# EAGLE design Bottom (EAGLE 9.6.2)
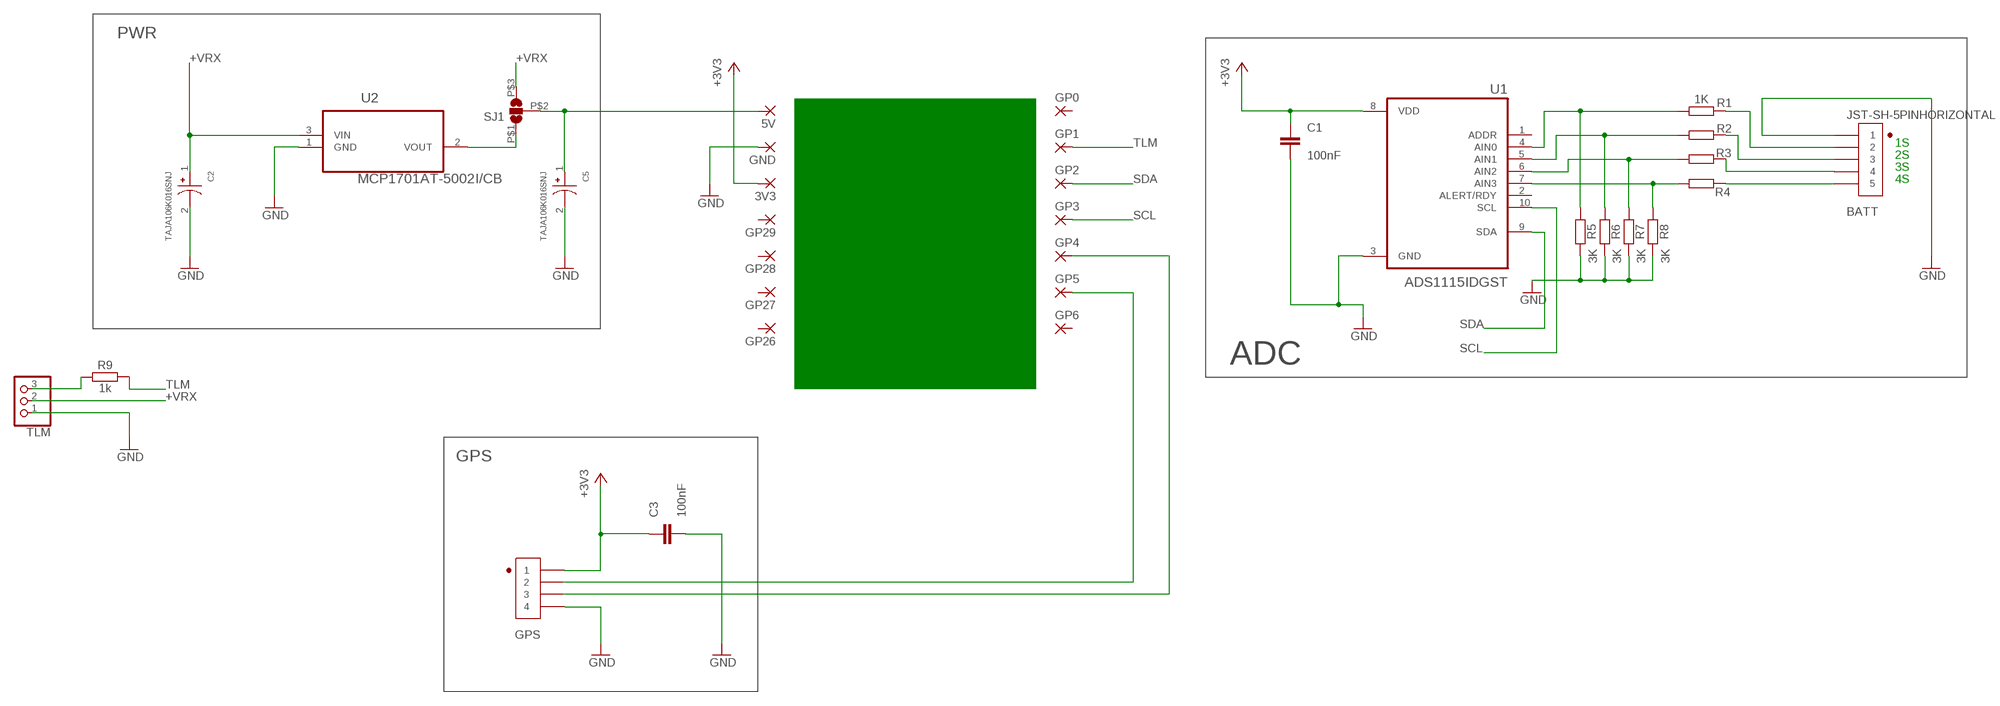
[diagram p0: schematic, sheet 1]

## Parts
3V3  1,6/0,9  [1,6/0,9]
5V  1,6/0,9  [1,6/0,9]
BATT  JST-SH-5PINHORIZONTAL  [JST-SH-5PIN-1.0MM]
C1  100nF  1.0UF-0603-16V-10%-X7R  [0603]
C2  TAJA106K016SNJ  [CAPMP3216X180N]
C3  100nF  1.0UF-0603-16V-10%-X7R  [0603]
C5  TAJA106K016SNJ  [CAPMP3216X180N]
GND  1,6/0,9  [1,6/0,9]
GP0  1,6/0,9  [1,6/0,9]
GP1  1,6/0,9  [1,6/0,9]
GP2  1,6/0,9  [1,6/0,9]
GP3  1,6/0,9  [1,6/0,9]
GP4  1,6/0,9  [1,6/0,9]
GP5  1,6/0,9  [1,6/0,9]
GP6  1,6/0,9  [1,6/0,9]
GP26  1,6/0,9  [1,6/0,9]
GP27  1,6/0,9  [1,6/0,9]
GP28  1,6/0,9  [1,6/0,9]
GP29  1,6/0,9  [1,6/0,9]
GPS  JST-SH-4PINJST-SH-4-HORIZONTAL  [JST-SH-4PIN-1.0MM]
R1  1K  RESISTOR0603  [0603]
R2  RESISTOR0603  [0603]
R3  RESISTOR0603  [0603]
R4  RESISTOR0603  [0603]
R5  3K  RESISTOR0603  [0603]
R6  3K  RESISTOR0603  [0603]
R7  3K  RESISTOR0603  [0603]
R8  3K  RESISTOR0603  [0603]
R9  1k  RESISTOR0603  [0603]
SJ1  SJ2WSJ_TINY  [SJ_TINY]
TLM  PINHD-1X390  [1X03-ANGLE]
U1  ADS1115IDGST  [SOP50P490X110-10N]
U2  MCP1701AT-5002I/CB  [SOT95P255X145-3N]

## Nets
+3V3: 3V3.1(P) C1.1 C3.1 GPS.1 U1.8(VDD)
+VRX: C2.1 SJ1.P$3 TLM.2 U2.3(VIN)
GND: BATT.1 C1.2 C2.2 C3.2 C5.2 GND.1(P) GPS.4 R5.2 R6.2 R7.2 R8.2 TLM.1 U1.3(GND) U2.1(GND)
N$1: R1.2 R5.1 U1.4(AIN0)
N$2: R2.2 R6.1 U1.5(AIN1)
N$3: R3.2 R7.1 U1.6(AIN2)
N$4: R4.2 R8.1 U1.7(AIN3)
N$5: BATT.5 R4.1
N$6: BATT.4 R3.1
N$7: BATT.3 R2.1
N$8: BATT.2 R1.1
N$9: R9.1 TLM.3
N$10: GP4.1(P) GPS.3
N$11: GP5.1(P) GPS.2
N$12: SJ1.P$1 U2.2(VOUT)
N$13: 5V.1(P) C5.1 SJ1.P$2
SCL: GP3.1(P) U1.10(SCL)
SDA: GP2.1(P) U1.9(SDA)
TLM: GP1.1(P) R9.2
Unconnected: GP0.1(P) GP6.1(P) GP26.1(P) GP27.1(P) GP28.1(P) GP29.1(P) U1.1(ADDR) U1.2(ALERT/RDY)

## Notes on the sheet
- PWR
- 1S
- RP2040-Zero | 2S
- 3S
- 4S
- ADC
- GPS

## Library data of the parts
3V3 5V GND GP0 GP1-GP6 GP26-GP29 = Codeworks-Pads:1,6/0,9: THROUGH-HOLE PAD
BATT = CodeWorks-Connectors:JST-SH-5PIN
C1 C3 = CodeWorks-Capacitors:1.0UF: 1µF ceramic capacitors A capacitor is a passive two-terminal electrical component used to store electrical energy temporarily in an electric field.; PROD_ID: CAP-13930; VALUE: 1.0uF
C2 C5 = CodeWorks-Capacitors:TAJA106K016SNJ: 1µF Molded Tantalum Capacitors 16V 1206 (3216 Metric) 11Ohm @ 100kHz Check availability <https://pricing.snapeda.com/parts/TAJA106K016SNJ/AVX/view-part?ref=eda>; AVAILABILITY: In Stock; CHECK_PRICES: https://www.snapeda.com/parts/TAJA106K016SNJ/AVX/view-part/?ref=eda; DESCRIPTION: Conventional MnO2,10 uF,16 V | AVX TAJA106K016SNJ; MF: AVX; MP: TAJA106K016SNJ; PACKAGE: 1206 AVX; PRICE: None; PURCHASE-URL: https://www.snapeda.com/api/url_track_click_mouser/?unipart_id=1685847&manufacturer=AVX&part_name=TAJA106K016SNJ&search_term=avx; SNAPEDA_LINK: https://www.snapeda.com/parts/TAJA106K016SNJ/AVX/view-part/?ref=snap
GPS = CodeWorks-Connectors:JST-SH-4PIN
R1-R9 = CodeWorks-Resistors:RESISTOR: Generic Resistor Package
SJ1 = CodeWorks-Essentials:SJ2W: SMD solder JUMPER
TLM = CodeWorks-Connectors:PINHD-1X3: PIN HEADER
U1 = CodeWorks-IO:ADS1115IDGST: Check availability <https://pricing.snapeda.com/parts/ADS1115IDGST/Texas%20Instruments/view-part?ref=eda>; AVAILABILITY: In Stock; CHECK_PRICES: https://www.snapeda.com/parts/ADS1115IDGST/Texas+Instruments/view-part/?ref=eda; DESCRIPTION: 16-bit, 860-SPS, 4-channel, delta-sigma ADC with PGA, oscillator, VREF, comparator and I2C; MF: Texas Instruments; MP: ADS1115IDGST; PACKAGE: VSSOP-10 Texas Instruments; PRICE: None; PURCHASE-URL: https://www.snapeda.com/api/url_track_click_mouser/?unipart_id=45901&manufacturer=Texas Instruments&part_name=ADS1115IDGST&search_term=ads1115; SNAPEDA_LINK: https://www.snapeda.com/parts/ADS1115IDGST/Texas+Instruments/view-part/?ref=snap
U2 = Codeworks-Voltage-Regulators:MCP1701AT-5002I/CB: IC, LDO REG, 250MA, 5.0V Check availability <https://pricing.snapeda.com/parts/MCP1701AT-5002I/CB/Microchip/view-part?ref=eda>; AVAILABILITY: In Stock; CHECK_PRICES: https://www.snapeda.com/parts/MCP1701AT-5002I/CB/Microchip/view-part/?ref=eda; DESCRIPTION: Microchip MCP1701AT-5002I/CB,LDO Voltage Regulator,250mA,5V +/-2%,3-Pin SOT-23A | Microchip Technology Inc. MCP1701AT-5002I/CB; MF: Microchip; MP: MCP1701AT-5002I/CB; PACKAGE: SOT-23 Microchip; PRICE: None; PURCHASE-URL: https://www.snapeda.com/api/url_track_click_mouser/?unipart_id=291195&manufacturer=Microchip&part_name=MCP1701AT-5002I/CB&search_term=mcp1701at-5002i/cb; SNAPEDA_LINK: https://www.snapeda.com/parts/MCP1701AT-5002I/CB/Microchip/view-part/?ref=snap

## Board
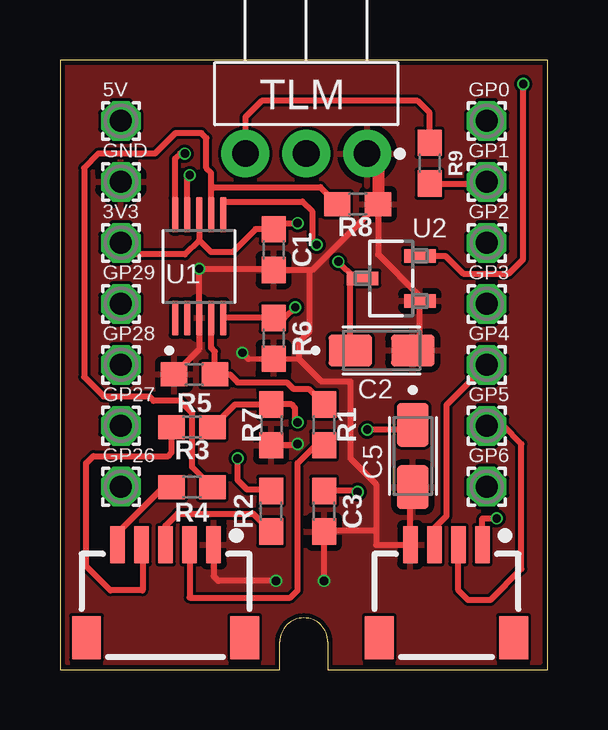
[diagram p1: board, top side]
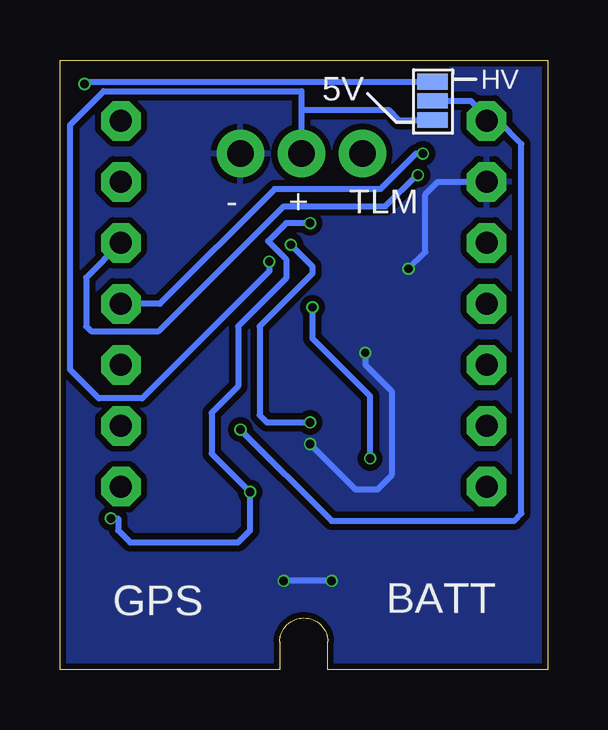
[diagram p2: board, bottom side, seen from below]

Size 20.32 x 25.4 mm. Coordinates in mm from the lower left corner, seen from the top.
Outline: 11.16,1.15 11.16,0 20.32,0 20.32,25.4 0,25.4 0,0 9.16,0 9.16,1.15 arc-180 11.16,1.15
Copper layers (1*16): Top 0.035mm / dielectric 1mm / Bottom 0.035mm
Design rules "jlcpcb-2layers *": minimum track width 5mil, minimum drill 0.3mm, track to track 5mil, track to pad 5mil, pad to pad 5mil, via to via 5mil, smd to smd 5mil, copper to edge 0.2mm, drill to drill 6mil, minimum pad ring 10mil, minimum via ring 3mil, stop-mask expansion 4mil, vias tented up to drill 0mil, thermal gap 10mil

### Footprints (pad centres in the part's own frame; a part is rotated, then mirrored left to right if it is on the bottom)
1,6/0,9 = drill 0.914 pad 1.6 octagon: 1 0,0
JST-SH-5PIN-1.0MM = smd 0.6 x 1.55: 1 0,0; 2 1,0; 3 2,0; 4 3,0; 5 4,0 | smd 1.2 x 1.8: M1 -1.3,3.875; M2 5.3,3.875
0603 = smd 1.1 x 1: 1 -0.85,0; 2 0.85,0
CAPMP3216X180N = smd 1.81 x 1.32: 1 -1.3,0; 2 1.3,0
JST-SH-4PIN-1.0MM = smd 0.6 x 1.55: 1 0,0; 2 1,0; 3 2,0; 4 3,0 | smd 1.2 x 1.8: M1 -1.3,3.875; M2 4.3,3.875
SJ_TINY = smd 0.66 x 1.27: P$1 0,0 | smd 0.635 x 1.27: P$2 0.8,0; P$3 1.6,0
1X03-ANGLE = drill 1.105 pad 1.705: 1 0,0; 2 2.54,0; 3 5.08,0
SOP50P490X110-10N = smd 1.47 x 0.28: 1 -2.15,1; 2 -2.15,0.5; 3 -2.15,0; 4 -2.15,-0.5; 5 -2.15,-1; 6 2.15,-1; 7 2.15,-0.5; 8 2.15,0; 9 2.15,0.5; 10 2.15,1
SOT95P255X145-3N = smd 0.559 x 1.321: 1 -0.94,-1.194; 2 0.94,-1.194; 3 0,1.194

### Placement (x,y rotation side)
3V3  2.54,17.78 0 top
5V  2.54,22.86 0 top
BATT  6.4,5.2 180 top
C1  8.9,17.5 270 top
C2  13.4,13.3 0 top
C3  11,6.6 270 top
C5  14.7,8.9 270 top
GND  2.54,20.32 0 top
GP0  17.78,22.86 0 top
GP1  17.78,20.32 0 top
GP2  17.78,17.78 0 top
GP3  17.78,15.24 0 top
GP4  17.78,12.7 0 top
GP5  17.78,10.16 0 top
GP6  17.78,7.62 0 top
GP26  2.54,7.62 0 top
GP27  2.54,10.16 0 top
GP28  2.54,12.7 0 top
GP29  2.54,15.24 0 top
GPS  17.6,5.2 180 top
R1  11,10.2 90 top
R2  8.8,6.6 90 top
R3  5.5,10.1 0 top
R4  5.5,7.6 0 top
R5  5.6,12.3 180 top
R6  8.9,13.8 270 top
R7  8.8,10.2 270 top
R8  12.4,19.4 0 top
R9  15.4,21.1 270 top
SJ1  4.8,24.5 270 bottom
TLM  12.8,21.5 180 top
U1  5.8,16.8 90 top
U2  13.8,16.3 90 top

### Tracks (layer width: path | path; a pad name or v marks a point on that pad's centre or on a via)
+3V3  (via drill 0.35)
  Top 0.254: U1.8 5.8,17.9 | 5.8,17.9 5.2,17.3 3.02,17.3 3V3.1 | GPS.1 17.6,6.3 v18.2,6.3 | 5.8,17.9 6.3,17.4 7.2,17.4 8.15,18.35 C1.1 9.15,18.6 v9.9,18.6 | v12.4,7.4 12.35,7.45 C3.1
  Bottom 0.254: v18.2,6.3 17.9,6.3 17.9,5.8 17.4,5.3 12.9,5.3 12.4,5.8 v12.4,7.4 14,9 14,10.7 12.9,11.8 12.9,14.3 10.9,16.3 10.9,17.1 11.65,17.85 10.9,18.6 v9.9,18.6
+VRX  (via drill 0.35)
  Top 0.254: C2.1 12.1,16.29 12.11,16.3 U2.3 12.3,16.3 v11.6,17
  Bottom 0.254: v11.6,17 11.6,16.6 16.9,11.3 18.7,11.3 19.9,12.5 19.9,22.7 18.5,24.1 10.26,24.1 10.26,23.3 | SJ1.P$3 6.2,22.9 6.6,23.3 10.26,23.3 | 10.26,23.3 TLM.2
GND  (via drill 0.35)
  Top 0.203: 7.85,12.95 R6.2 9.95,12.95
  Top 0.254: TLM.1 13.25,21.05 | R5.2 5.8,13.35 U1.3 v5.8,16.7 8.85,16.7 C1.2 10.4,16.65 | C5.2 14.6,7.5 GPS.4 13.17,5.2 13.17,5.8 | BATT.1 6.4,3.9 6.6,3.7 v9,3.7 | v11,3.7 C3.2 11.05,5.8 13.17,5.8 | C2.2 14.99,13.59 U2.1 14.99,15.56 13.25,17.3 R8.2 10.5,16.65 10.4,16.65 | 10.4,16.65 10.4,14.1 9.95,13.65 9.95,12.95 10.9,12 12.1,12 12.1,8.8 13.17,7.73 13.17,5.8 | v7.6,13.2 7.85,12.95 | v9.9,9.4 9.85,9.35 R7.2
  Top 0.508: 13.25,21.05 R8.2
  Bottom 0.254: v5.8,16.7 5.1,17.4 5.1,19.8 4.58,20.32 GND.1 | v9,3.7 v11,3.7 | v7.6,13.2 7.6,12.7 6.5,11.6 6.5,8.1 7.1,7.5 8,7.5 v9.9,9.4
  pour Bottom (isolate 0.254): 0.1,25.2 20.1,25.2 20.1,0.2 0.1,0.2
  pour Top: 0.3,0.3 20,0.3 20,25.2 0.3,25.2
N$1
  Top 0.254: R1.2 10.36,11.7 9.72,11.7 9.45,11.97 7.41,11.97 7.08,12.3 R5.1 6.45,13.25 6.3,13.4 U1.4
N$2  (via drill 0.35)
  Top 0.254: R2.2 8.75,7.5 7.8,7.5 7.4,7.9 v7.4,8.8 | v9.8,15.1 9.35,14.65 R6.1 U1.5
  Bottom 0.254: v7.4,8.8 7.4,11.4 9.8,13.8 v9.8,15.1
N$3  (via drill 0.35)
  Top 0.254: R3.2 7.3,11.05 R7.1 9.65,11.05 9.8,10.9 9.8,10.4 v9.9,10.3 | U1.6 6.8,19.5 10.1,19.5 10.5,19.1 10.5,17.9 v10.7,17.7
  Bottom 0.254: v10.7,17.7 9.8,16.8 9.8,16.5 12,14.3 12,10.6 11.7,10.3 v9.9,10.3
N$4
  Top 0.254: R8.1 10.85,20.1 6.4,20.1 6.3,20 U1.7 6.3,20.7 6.1,20.9 6.1,22.14 5.89,22.35 4.81,22.35 3.96,21.5 1.6,21.5 1,20.9 1,12.2 1.81,11.39 3.71,11.39 3.9,11.2 4.99,11.2 5.5,10.68 5.5,8.45 R4.2
N$5
  Top 0.254: BATT.5 2.4,5.7 4.3,7.6 R4.1
N$6
  Top 0.254: BATT.4 3.45,5.13 3.45,3.3 2.1,3.3 1.09,4.31 1.09,8.6 1.39,8.9 4.5,8.9 4.65,9.05 R3.1
N$7
  Top 0.254: R2.1 8.05,6.5 4.9,6.5 4.4,6 BATT.3
N$8
  Top 0.254: BATT.2 5.4,3 9.6,3 9.9,3.3 9.9,8.6 10.65,9.35 R1.1
N$9
  Top 0.254: R9.1 15.4,23.2 14.9,23.7 8.4,23.7 7.72,23.02 TLM.3
N$10
  Top 0.152: 15.6,5.9 GPS.3
  Top 0.254: GP4.1 16.6,11.52 16.1,11.02 16.1,6.4 15.6,5.9
N$11
  Top 0.254: GP5.1 18.47,10.16 19.23,9.4 19.23,4.2 17.93,2.9 17,2.9 16.6,3.3 GPS.2
N$12  (via drill 0.35)
  Top 0.254: U2.2 16.06,17.24 16.8,16.5 18.7,16.5 19.3,17.1 v19.3,24.4
  Bottom 0.254: v19.3,24.4 19.2,24.5 SJ1.P$1
N$13  (via drill 0.35)
  Top 0.254: C5.1 14.5,10 v12.8,10
  Bottom 0.254: v12.8,10 9,6.2 1.4,6.2 1.09,6.51 1.09,21.9 2.05,22.86 5V.1 2.54,23.04 3.2,23.7 SJ1.P$2
SCL  (via drill 0.35)
  Top 0.254: U1.10 4.8,21.3 5,21.5 v5.2,21.5
  Bottom 0.254: v5.2,21.5 5.49,21.5 6.97,20.02 11.38,20.02 16.16,15.24 GP3.1
SDA  (via drill 0.35)
  Top 0.254: U1.9 5.3,20.49 v5.41,20.6
  Bottom 0.152: v5.41,20.6 5.46,20.6
  Bottom 0.254: 5.46,20.6 6.76,19.3 11,19.3 16.2,14.1 19.03,14.1 19.23,14.3 19.23,16.33 GP2.1
TLM
  Top 0.254: R9.2 17.71,20.25 GP1.1

### Text on the board
bNames: HV | 5V | TLM | + | -